# EAGLE design PCB_Assignment (EAGLE 8.3.2)
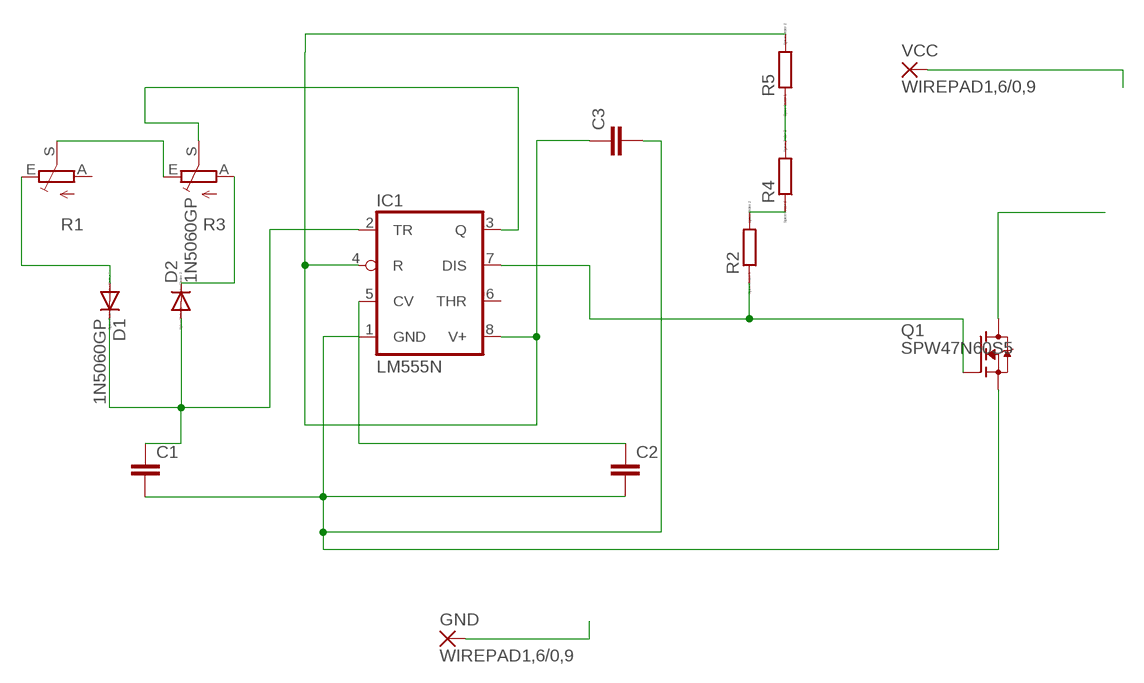
[diagram p0: schematic, sheet 1]

## Parts
C1  C2.5/2  [C2.5-2]
C2  C2.5/2  [C2.5-2]
C3  C2.5/2  [C2.5-2]
D1  1N5060GP  [DO15-12]
D2  1N5060GP  [DO15-12]
GND  WIREPAD1,6/0,9  [1,6/0,9]
IC1  LM555N  [DIL08]
Q1  SPW47N60S5  [P-TO247]
R1  TRIM_EU-B64Y  [B64Y]
R2  R0204/7  [0204/7]
R3  TRIM_EU-B64Y  [B64Y]
R4  R0204/7  [0204/7]
R5  R0204/7  [0204/7]
VCC  WIREPAD1,6/0,9  [1,6/0,9]

## Nets
GND: C1.2 C2.2 C3.2 GND.1(P) IC1.1(GND) Q1.3(S)
N$1: IC1.7(DIS) Q1.1(G) R2.1
N$2: C1.1 D1.C D2.A IC1.2(TR)
N$3: D2.C R3.A
N$4: D1.A R1.E
N$5: IC1.3(Q) R3.S
N$6: R1.S R3.E
N$7: Q1.2(D)
N$8: C2.1 IC1.5(CV)
N$9: R2.2 R4.1
N$10: R4.2 R5.1
VCC: C3.1 IC1.4(R) IC1.8(V+) R5.2 VCC.1(P)
Unconnected: IC1.6(THR) R1.A

## Library data of the parts
C1-C3 = capacitor-wima:C: CAPACITOR naming: grid - package width
D1 D2 = diode:1N5060GP: DIODE controlled avalanche rectifier
GND VCC = wirepad:WIREPAD: Wire PAD connect wire on PCB
IC1 = linear:*555: TIMER
Q1 = transistor-fet:SPW47N60S5: Cool MOS Power Transistor
R1 R3 = pot:TRIM_EU-: POTENTIOMETER
R2 R4 R5 = eagle-ltspice:R: RESISTOR, European symbol; SPICEMODEL: NONE; SPICEPREFIX: R

## Board
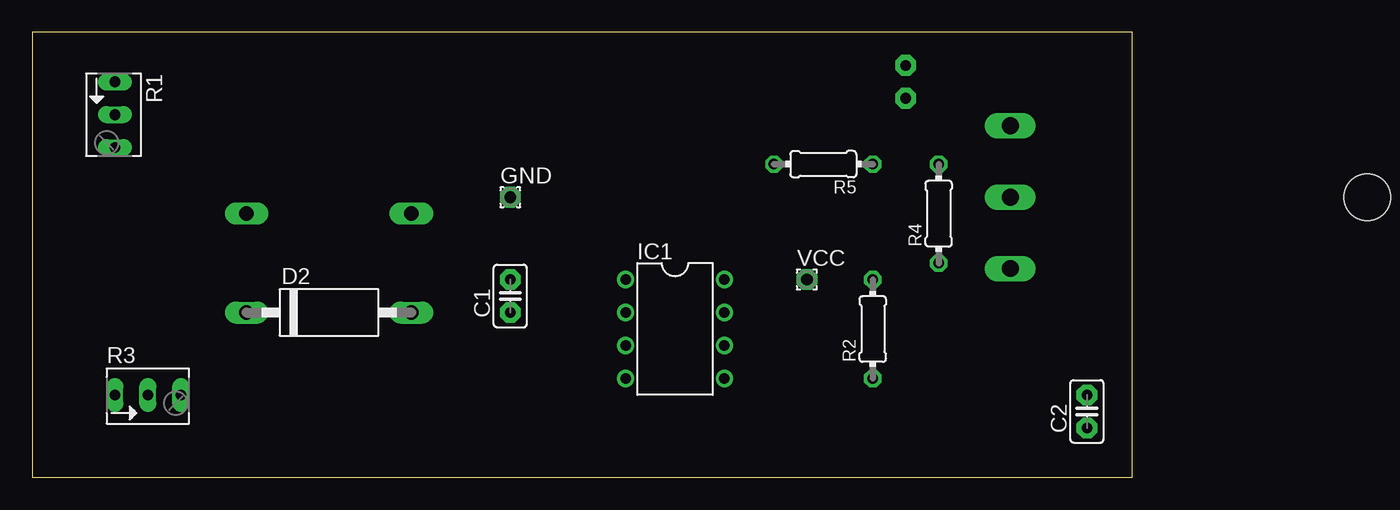
[diagram p1: board, top side]
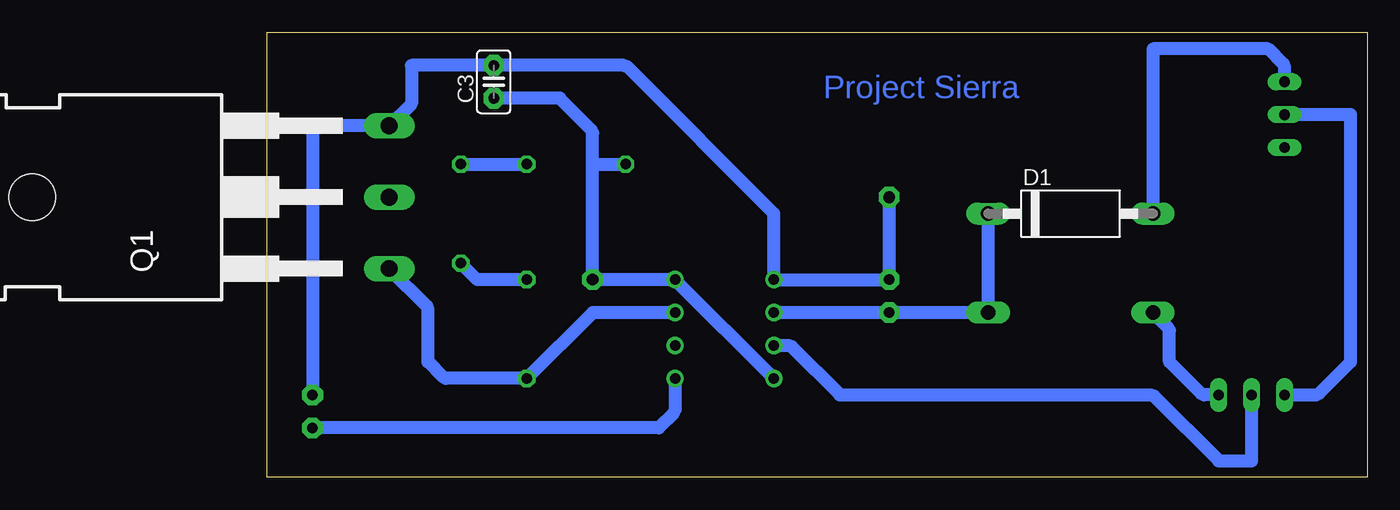
[diagram p2: board, bottom side, seen from below]

Size 84.76 x 34.28 mm. Coordinates in mm from the lower left corner, seen from the top.
Outline: 0,0 84.76,0 84.76,34.28 0,34.28 0,0
Copper layers (1*16): Top 0.035mm / dielectric 1.5mm / Bottom 0.035mm
Design rules "default": minimum track width 6mil, minimum drill 0.35mm, track to track 6mil, track to pad 6mil, pad to pad 6mil, via to via 6mil, smd to smd 6mil, copper to edge 40mil, drill to drill 6mil, minimum pad ring 10mil, minimum via ring 8mil, stop-mask expansion 4mil, vias tented up to drill 0mil, thermal gap 10mil

### Footprints (pad centres in the part's own frame; a part is rotated, then mirrored left to right if it is on the bottom)
C2.5-2 = drill 0.813 pad 1.6 octagon: 1 -1.27,0; 2 1.27,0
DO15-12 = drill 1.118 long: A 6.35,0; C -6.35,0
1,6/0,9 = drill 0.914 pad 1.6 octagon: 1 0,0
DIL08 = drill 0.813 pad 1.27: 1 -3.81,-3.81; 2 -1.27,-3.81; 3 1.27,-3.81; 4 3.81,-3.81; 5 3.81,3.81; 6 1.27,3.81; 7 -1.27,3.81; 8 -3.81,3.81
P-TO247 = drill 1.3 long: 1 -5.5,-27.5; 2 0,-27.5; 3 5.5,-27.5 | hole 3.6: 0,0
B64Y = drill 0.813 long: A 2.54,0; E -2.54,0; S 0,0
0204/7 = drill 0.813 octagon: 1 -3.81,0; 2 3.81,0

### Placement (x,y rotation side)
C1  36.83,13.97 90 top
C2  81.28,5.08 90 top
C3  67.31,30.48 90 bottom
D1  22.86,20.32 0 bottom
D2  22.86,12.7 0 top
GND  36.83,21.59 0 top
IC1  49.53,11.43 270 top
Q1  102.87,21.59 90 bottom
R1  6.35,27.94 270 top
R2  64.77,11.43 90 top
R3  8.89,6.35 0 top
R4  69.85,20.32 90 top
R5  60.96,24.13 180 top
VCC  59.69,15.24 0 top

### Tracks (layer width: path | path; a pad name or v marks a point on that pad's centre or on a via)
GND
  Bottom 0.152: 80.73,27.09 arc-45 80.95,27 | 57.28,31.75 arc45 57.06,31.66
  Bottom 1: 80.73,27.09 Q1.3 73.66,28.8 73.66,31.75 C3.2 57.28,31.75 | 80.95,27 81.28,26.67 C2.2 | 57.06,31.66 45.72,20.32 IC1.1 C1.2 GND.1
N$1
  Bottom 0.152: 70.99,7.62 arc45 71.21,7.71 | 72.39,12.98 arc-45 72.48,13.2
  Bottom 1: IC1.7 59.69,12.7 R2.1 70.99,7.62 | 71.21,7.71 72.39,8.89 72.39,12.98 | 72.48,13.2 Q1.1
N$2
  Bottom 1: D1.C D2.A C1.1 IC1.2
N$3
  Bottom 0.152: 12.57,6.35 arc45 12.79,6.44 | 15.24,11.3 arc-45 15.33,11.52
  Bottom 1: R3.A 12.57,6.35 | 12.79,6.44 15.24,8.89 15.24,11.3 | 15.33,11.52 D2.C
N$4
  Bottom 0.152: 6.35,31.62 arc-45 6.44,31.84
  Bottom 1: R1.E 6.35,31.62 | 6.44,31.84 7.62,33.02 16.51,33.02 D1.A
N$5
  Bottom 0.152: 44.58,10.16 arc45 44.36,10.07 | 16.64,6.35 arc45 16.42,6.26
  Bottom 1: IC1.3 44.58,10.16 | 44.36,10.07 40.64,6.35 16.64,6.35 | 16.42,6.26 11.43,1.27 8.89,1.27 R3.S
N$6
  Bottom 0.152: 3.94,6.35 arc-45 3.72,6.44
  Bottom 1: R3.E 3.94,6.35 | 3.72,6.44 1.27,8.89 1.27,27.94 R1.S
N$8
  Bottom 0.152: 53.34,5.21 arc45 53.43,4.99
  Bottom 1: IC1.5 53.34,5.21 | 53.43,4.99 54.61,3.81 C2.1
N$9
  Bottom 1: R2.2 68.58,15.24 R4.1
N$10
  Bottom 1: R4.2 R5.1
VCC
  Bottom 0.152: 59.69,26.54 arc-45 59.78,26.76
  Bottom 1: 59.69,24.13 VCC.1 IC1.8 IC1.4 | 59.69,24.13 R5.2 | 59.69,24.13 59.69,26.54 | 59.78,26.76 62.23,29.21 C3.1

### Text on the board
Bottom: Project Sierra